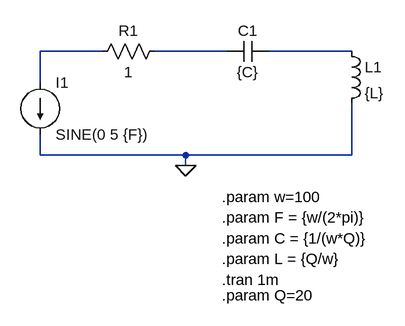
[diagram p0: schematic Circuito RLC con fuente de corriente (Serie).asc]
Circuito RLC con fuente de corriente (Serie).asc, the LTspice schematic file:
Version 4
SHEET 1 880 680
WIRE 160 96 64 96
WIRE 352 96 240 96
WIRE 544 96 416 96
WIRE 64 144 64 96
WIRE 64 256 64 224
WIRE 288 256 64 256
WIRE 544 256 544 176
WIRE 544 256 288 256
WIRE 288 272 288 256
FLAG 288 272 0
SYMBOL res 256 80 R90
WINDOW 0 0 56 VBottom 2
WINDOW 3 32 56 VTop 2
SYMATTR InstName R1
SYMATTR Value 1
SYMBOL cap 416 80 R90
WINDOW 0 0 32 VBottom 2
WINDOW 3 32 32 VTop 2
SYMATTR InstName C1
SYMATTR Value {C}
SYMBOL ind 528 80 R0
SYMATTR InstName L1
SYMATTR Value {L}
SYMBOL current 64 144 R0
WINDOW 123 0 0 Left 0
WINDOW 39 0 0 Left 0
SYMATTR InstName I1
SYMATTR Value SINE(0 5 {F})
TEXT 344 320 Left 2 !.param w=100
TEXT 344 472 Left 2 !.param Q=20
TEXT 344 384 Left 2 !.param C = {1/(w*Q)}
TEXT 344 416 Left 2 !.param L = {Q/w}
TEXT 344 352 Left 2 !.param F = {w/(2*pi)}
TEXT 344 448 Left 2 !.tran 1m

The netlist it stands for:
* Circuito RLC con fuente de corriente (Serie).asc
R1 N002 N001 1
C1 N003 N002 {C}
L1 N003 0 {L}
I1 N001 0 SINE(0 5 {F})
.param w=100
.param Q=20
.param C = {1/(w*Q)}
.param L = {Q/w}
.param F = {w/(2*pi)}
.tran 1m
.backanno
.end